# Altium schematic sheet 08-AUDIO_OUTER.SchDoc
size B
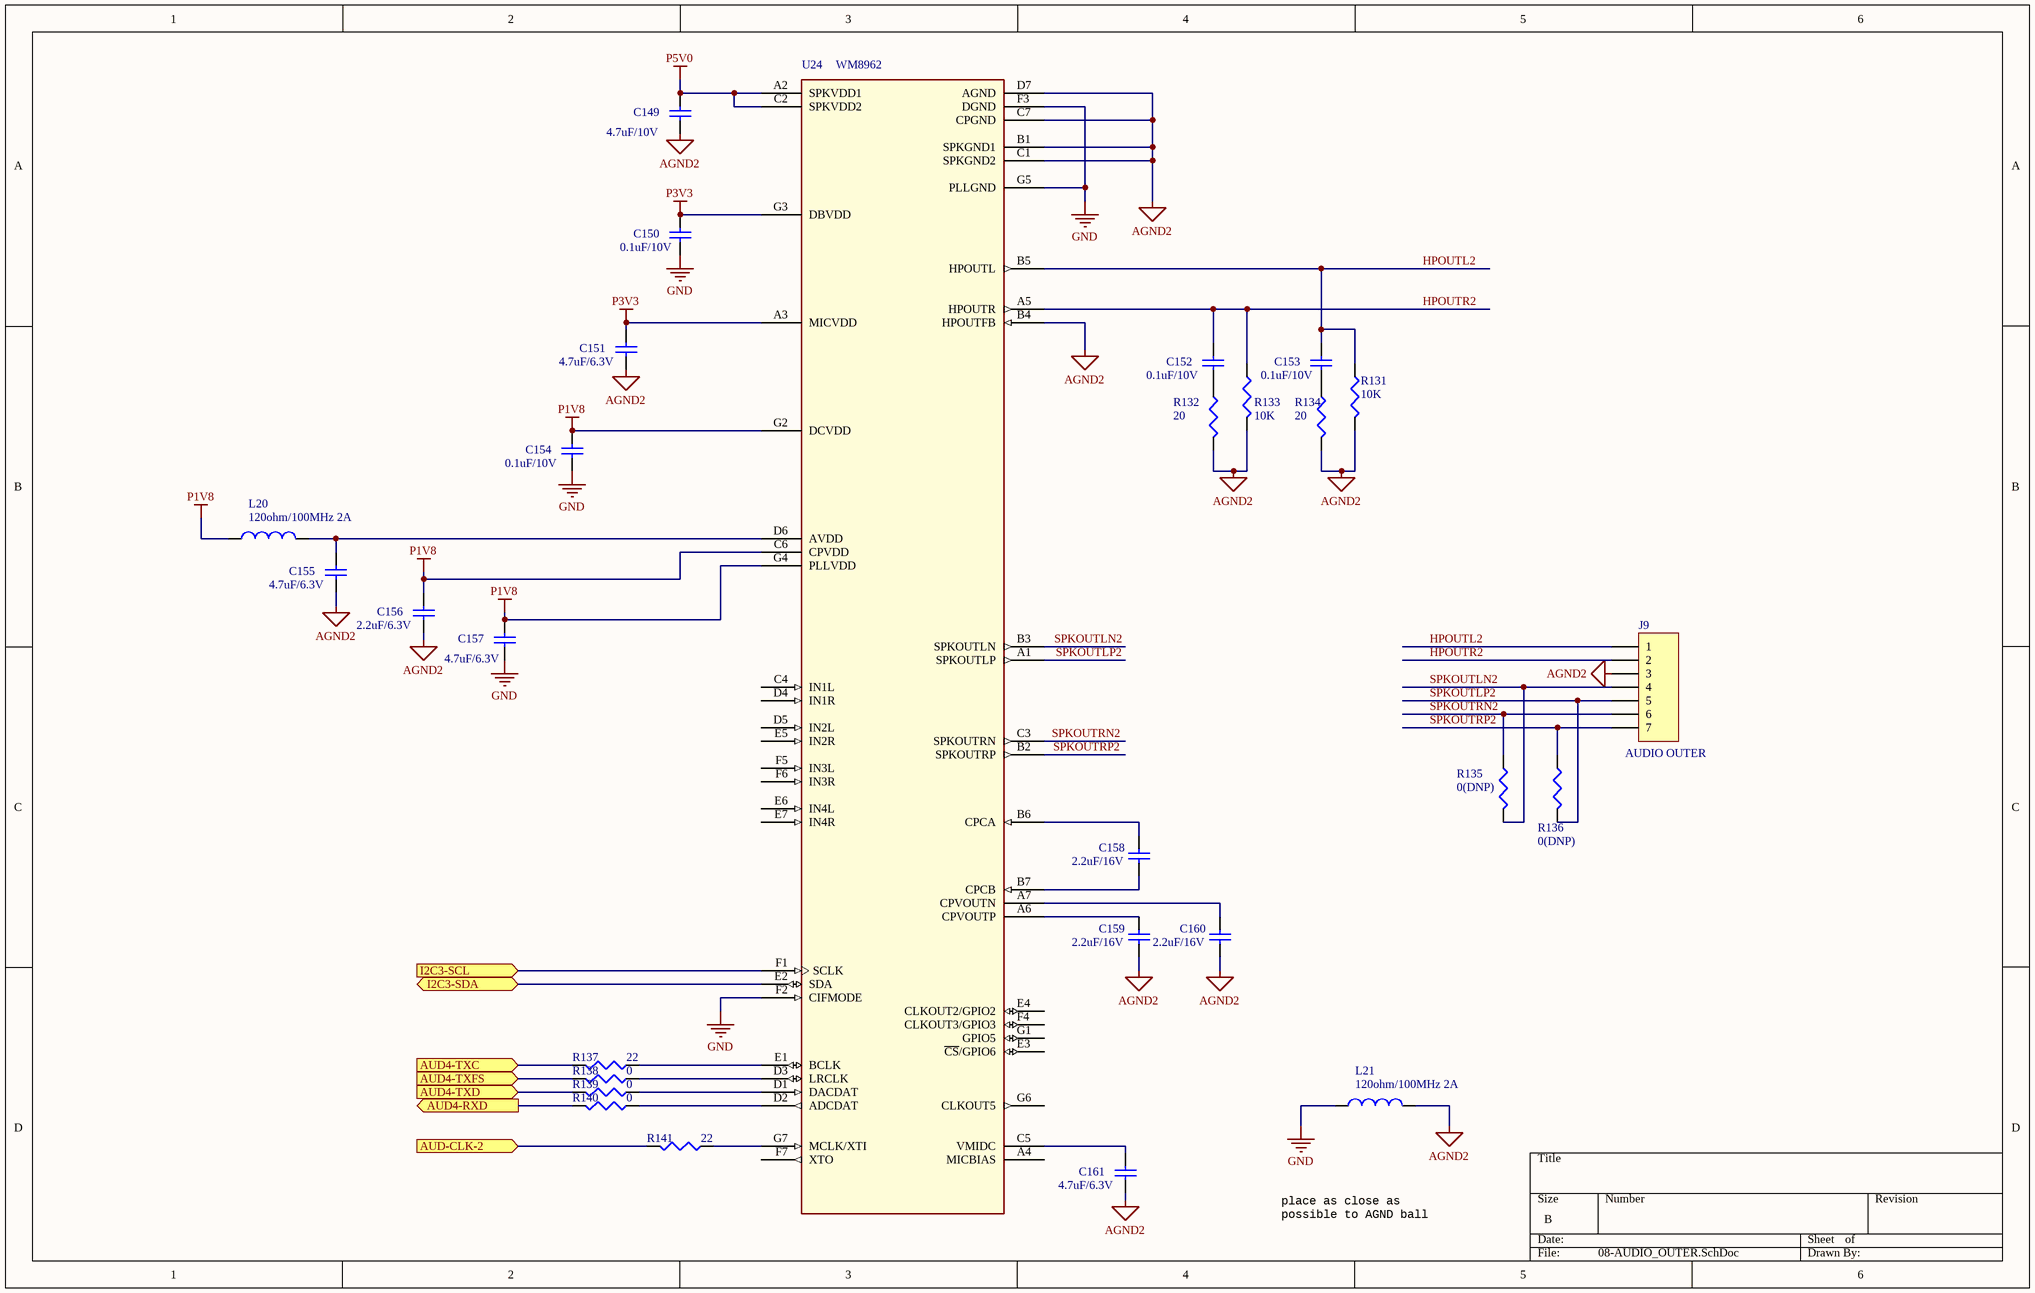
[diagram p0: 08-AUDIO_OUTER.SchDoc]

## Parts
C149  4.7uF/10V  [0805]
C150  0.1uF/10V  [0402]
C151  4.7uF/6.3V  [0603]
C152  0.1uF/10V  [0402]
C153  0.1uF/10V  [0402]
C154  0.1uF/10V  [0402]
C155  4.7uF/6.3V  [0603]
C156  2.2uF/6.3V  [0603]
C157  4.7uF/6.3V  [0603]
C158  2.2uF/16V  [0603]
C159  2.2uF/16V  [0603]
C160  2.2uF/16V  [0603]
C161  4.7uF/6.3V  [0603]
J9  AUDIO OUTER  [CON-7PIN]
L20  120ohm/100MHz 2A  [0603]
L21  120ohm/100MHz 2A  [0603]
R131  10K  [0402]
R132  20  [0402]
R133  10K  [0402]
R134  20  [0402]
R135  0(DNP)  [0603]
R136  0(DNP)  [0603]
R137  22  [0402]
R138  0  [0402]
R139  0  [0402]
R140  0  [0402]
R141  22  [0402]
U24  WM8962  [BGA49]

## Ports
AUD4-RXD (out), AUD4-TXC (in), AUD4-TXD (in), AUD4-TXFS (in), AUD-CLK-2 (in), I2C3-SCL (in), I2C3-SDA (bidir)

## Nets
AGND2: C149.1 C151.1 C155.1 C156.1 C159.1 C160.1 C161.1 J9.3 L21.2 R131.2 R132.2 R133.2 R134.2 U24.B1(SPKGND1) U24.B4(HPOUTFB) U24.C1(SPKGND2) U24.C7(CPGND) U24.D7(AGND)
GND: C150.1 C154.1 C157.1 L21.1 U24.F2(CIFMODE) U24.F3(DGND) U24.G5(PLLGND)
P1V8: C154.2 C156.2 C157.2 L20.1 U24.C6(CPVDD) U24.G2(DCVDD) U24.G4(PLLVDD)
P3V3: C150.2 C151.2 U24.A3(MICVDD) U24.G3(DBVDD)
P5V0: C149.2 U24.A2(SPKVDD1) U24.C2(SPKVDD2)
AUD4-RXD: R140.2 ; port AUD4-RXD
AUD4-TXC: R137.2 ; port AUD4-TXC
AUD4-TXD: R139.2 ; port AUD4-TXD
AUD4-TXFS: R138.2 ; port AUD4-TXFS
AUD-CLK-2: R141.2 ; port AUD-CLK-2
HPOUTL2: C153.2 J9.1 R131.1 U24.B5(HPOUTL)
HPOUTR2: C152.2 J9.2 R133.1 U24.A5(HPOUTR)
I2C3-SCL: U24.F1(SCLK) ; port I2C3-SCL
I2C3-SDA: U24.E2(SDA) ; port I2C3-SDA
SPKOUTLN2: J9.4 R135.2 U24.B3(SPKOUTLN)
SPKOUTLP2: J9.5 R136.2 U24.A1(SPKOUTLP)
SPKOUTRN2: J9.6 R135.1 U24.C3(SPKOUTRN)
SPKOUTRP2: J9.7 R136.1 U24.B2(SPKOUTRP)
NetC152_1: C152.1 R132.1
NetC153_1: C153.1 R134.1
NetC155_2: C155.2 L20.2 U24.D6(AVDD)
NetC158_1: C158.1 U24.B7(CPCB)
NetC158_2: C158.2 U24.B6(CPCA)
NetC159_2: C159.2 U24.A6(CPVOUTP)
NetC160_2: C160.2 U24.A7(CPVOUTN)
NetC161_2: C161.2 U24.C5(VMIDC)
NetR137_1: R137.1 U24.E1(BCLK)
NetR138_1: R138.1 U24.D3(LRCLK)
NetR139_1: R139.1 U24.D1(DACDAT)
NetR140_1: R140.1 U24.D2(ADCDAT)
NetR141_1: R141.1 U24.G7(MCLK/XTI)

Not connected (* = marked no-connect by the designer): U24 A4(MICBIAS) C4(IN1L) D4(IN1R) D5(IN2L) E3(~{CS}/GPIO6) E4(CLKOUT2/GPIO2) E5(IN2R) E6(IN4L) E7(IN4R) F4(CLKOUT3/GPIO3) F5(IN3L) F6(IN3R) F7(XTO) G1(GPIO5) G6(CLKOUT5)

## Notes on the sheet
- place as close as
  possible to AGND ball

## Library data of the parts
C149-C161 = Cap: Capacitor; Published: 8-Jun-2000; LatestRevisionDate: 17-Jul-2002; LatestRevisionNote: Re-released for DXP Platform.; PackageReference: RAD-0.3; Publisher: Altium Limited; PackageDescription: Radial Cap, Thru-Hole; 2 Leads; 0.3 in Pin Spacing
J9 = Header 7: Header, 7-Pin; LatestRevisionDate: 17-Jul-2002; LatestRevisionNote: Re-released for DXP Platform.; Publisher: Altium Limited
L20 L21 = Inductor: Code_IEC: 1005; Value: 300ohm/100MHz BEAD; Published: 8-Jun-2000; LatestRevisionDate: 29-May-2009; LatestRevisionNote: IPC-7351 Footprint Added.; PackageReference: 0402-A; Publisher: Altium Limited; PackageDescription: Chip Inductor; Code_JEITA: 0402
R131-R141 = CR16-1003FM
U24 = WM8962_BGA_49P_CUST: IC AUDIO CODEC 24BIT DAC 2 CH ADC 1.8V BGA49; AGILE_PN: 315-79434; MFG_NAME01: WOLFSON MICROELECTRONICS; MFG_PN01: WM8962ECSN/R; CAD_APPROVED: Yes; FPLIST: bga49_0p5_3p62x4,bga49_0p5_3p62x4_smdp; CLASS: IC; ROHS: Yes; HEIGHT: 0.75MM